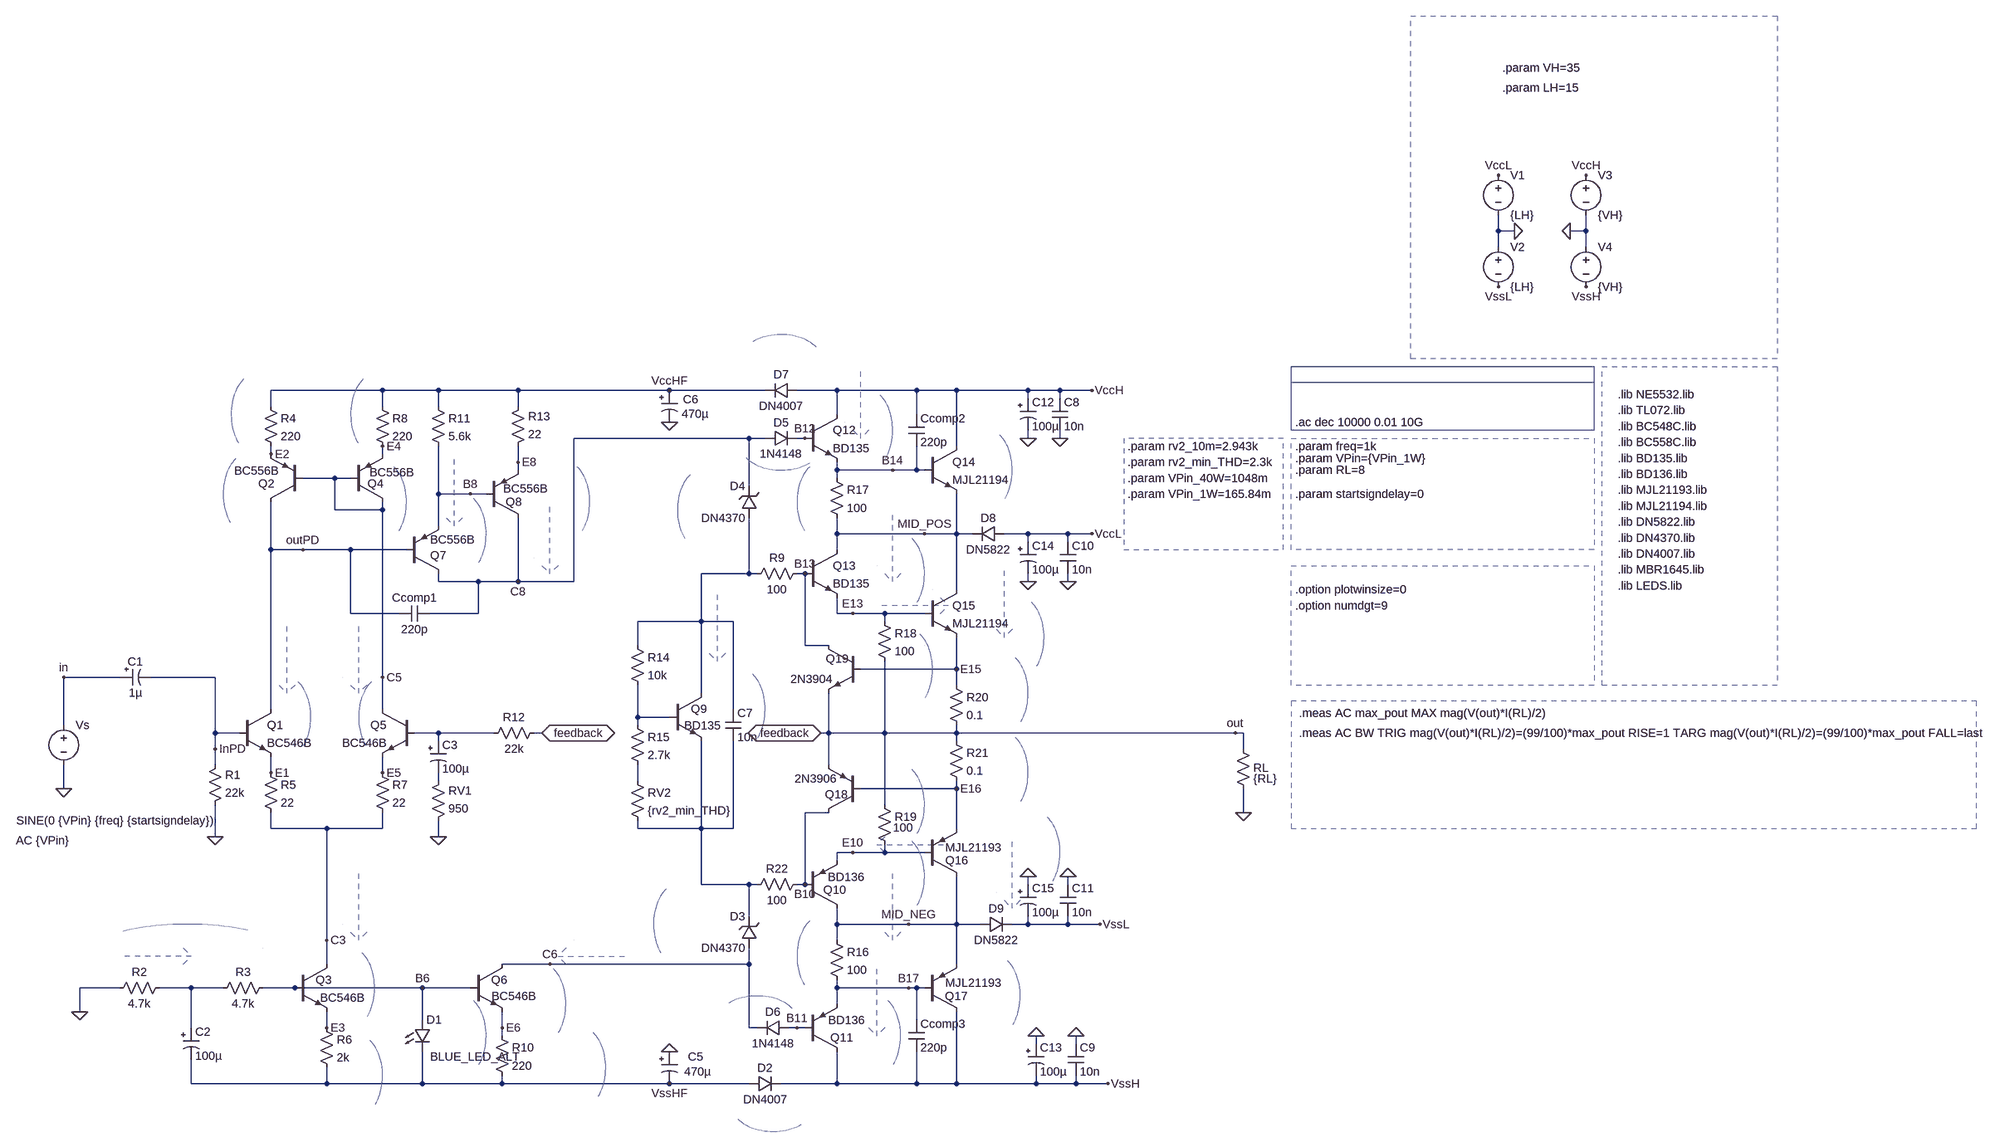
[diagram p0: schematic amplifier_1W_BW.asc]
amplifier_1W_BW.asc, the LTspice schematic file:
Version 4
SHEET 1 4560 1660
WIRE 3568 -400 3568 -432
WIRE 3600 -400 3568 -400
WIRE 3744 -400 3744 -432
WIRE 3744 -400 3712 -400
WIRE 3568 -368 3568 -400
WIRE 3744 -368 3744 -400
WIRE 1328 -80 1104 -80
WIRE 1440 -80 1328 -80
WIRE 1600 -80 1440 -80
WIRE 1904 -80 1600 -80
WIRE 2096 -80 1904 -80
WIRE 2240 -80 2160 -80
WIRE 2400 -80 2240 -80
WIRE 2480 -80 2400 -80
WIRE 2624 -80 2480 -80
WIRE 2688 -80 2624 -80
WIRE 2752 -80 2688 -80
WIRE 2624 -64 2624 -80
WIRE 2688 -64 2688 -80
WIRE 1104 -48 1104 -80
WIRE 1328 -48 1328 -80
WIRE 1440 -48 1440 -80
WIRE 1600 -48 1600 -80
WIRE 2240 -32 2240 -80
WIRE 2400 -32 2400 -80
WIRE 2064 16 1712 16
WIRE 2096 16 2064 16
WIRE 2176 16 2160 16
WIRE 2624 16 2624 0
WIRE 2688 16 2688 0
WIRE 2480 32 2480 -80
WIRE 1104 48 1104 32
WIRE 1328 48 1328 32
WIRE 1600 64 1600 32
WIRE 1600 80 1600 64
WIRE 2240 80 2240 64
WIRE 2352 80 2240 80
WIRE 2400 80 2400 32
WIRE 2400 80 2352 80
WIRE 2416 80 2400 80
WIRE 1232 96 1168 96
WIRE 1264 96 1232 96
WIRE 2240 96 2240 80
WIRE 2064 112 2064 16
WIRE 1440 128 1440 32
WIRE 1504 128 1440 128
WIRE 1536 128 1504 128
WIRE 1232 160 1232 96
WIRE 1328 160 1328 144
WIRE 1328 160 1232 160
WIRE 1440 192 1440 128
WIRE 2240 208 2240 176
WIRE 2416 208 2240 208
WIRE 2480 208 2480 128
WIRE 2480 208 2416 208
WIRE 2512 208 2480 208
WIRE 2624 208 2576 208
WIRE 2704 208 2624 208
WIRE 2752 208 2704 208
WIRE 2624 224 2624 208
WIRE 2704 224 2704 208
WIRE 1104 240 1104 144
WIRE 1168 240 1104 240
WIRE 1264 240 1168 240
WIRE 1376 240 1264 240
WIRE 2240 240 2240 208
WIRE 2064 288 2064 176
WIRE 2064 288 1968 288
WIRE 2080 288 2064 288
WIRE 2176 288 2160 288
WIRE 1440 304 1440 288
WIRE 1520 304 1440 304
WIRE 1600 304 1600 176
WIRE 1600 304 1520 304
WIRE 1712 304 1712 16
WIRE 1712 304 1600 304
WIRE 2624 304 2624 288
WIRE 2704 304 2704 288
WIRE 2480 320 2480 208
WIRE 1264 368 1264 240
WIRE 1360 368 1264 368
WIRE 1520 368 1520 304
WIRE 1520 368 1424 368
WIRE 2240 368 2240 336
WIRE 2272 368 2240 368
WIRE 2336 368 2272 368
WIRE 2416 368 2336 368
WIRE 1968 384 1968 288
WIRE 1968 384 1840 384
WIRE 2032 384 1968 384
WIRE 2336 384 2336 368
WIRE 1840 432 1840 384
WIRE 2176 432 2176 288
WIRE 2224 432 2176 432
WIRE 2480 480 2480 416
WIRE 2480 480 2288 480
WIRE 800 496 688 496
WIRE 992 496 864 496
WIRE 1328 496 1328 160
WIRE 2480 512 2480 480
WIRE 1968 528 1968 384
WIRE 1104 560 1104 240
WIRE 1328 560 1328 496
WIRE 2032 560 2032 384
WIRE 1840 576 1840 512
WIRE 1904 576 1840 576
WIRE 688 592 688 496
WIRE 1840 592 1840 576
WIRE 992 608 992 496
WIRE 1040 608 992 608
WIRE 1440 608 1392 608
WIRE 1552 608 1440 608
WIRE 1648 608 1632 608
WIRE 2224 608 2224 528
WIRE 2224 608 2208 608
WIRE 2336 608 2336 464
WIRE 2336 608 2224 608
WIRE 2480 608 2480 592
WIRE 2480 608 2336 608
WIRE 3040 608 2480 608
WIRE 3056 608 3040 608
WIRE 1440 624 1440 608
WIRE 2480 624 2480 608
WIRE 992 640 992 608
WIRE 3056 640 3056 608
WIRE 992 672 992 640
WIRE 2224 672 2224 608
WIRE 1104 688 1104 656
WIRE 1328 688 1328 656
WIRE 1440 704 1440 688
WIRE 1840 704 1840 672
WIRE 688 720 688 672
WIRE 2480 720 2480 704
WIRE 2480 720 2288 720
WIRE 2336 752 2336 608
WIRE 2224 768 2176 768
WIRE 3056 768 3056 720
WIRE 1104 800 1104 768
WIRE 1216 800 1104 800
WIRE 1328 800 1328 768
WIRE 1328 800 1216 800
WIRE 1840 800 1840 784
WIRE 1968 800 1968 624
WIRE 1968 800 1840 800
WIRE 2032 800 2032 624
WIRE 2032 800 1968 800
WIRE 2480 800 2480 720
WIRE 992 816 992 752
WIRE 1440 816 1440 784
WIRE 2272 848 2240 848
WIRE 2336 848 2336 832
WIRE 2336 848 2272 848
WIRE 2416 848 2336 848
WIRE 2240 864 2240 848
WIRE 1968 912 1968 800
WIRE 2064 912 1968 912
WIRE 2080 912 2064 912
WIRE 2176 912 2176 768
WIRE 2176 912 2160 912
WIRE 2624 912 2624 896
WIRE 2704 912 2704 896
WIRE 2064 976 2064 912
WIRE 2240 992 2240 960
WIRE 2384 992 2240 992
WIRE 2480 992 2480 896
WIRE 2480 992 2384 992
WIRE 2528 992 2480 992
WIRE 2624 992 2624 976
WIRE 2624 992 2592 992
WIRE 2704 992 2704 976
WIRE 2704 992 2624 992
WIRE 2768 992 2704 992
WIRE 1216 1024 1216 800
WIRE 2240 1024 2240 992
WIRE 1216 1072 1216 1024
WIRE 1664 1072 1568 1072
WIRE 2064 1072 2064 1040
WIRE 2064 1072 1664 1072
WIRE 2480 1072 2480 992
WIRE 800 1120 720 1120
WIRE 944 1120 880 1120
WIRE 1008 1120 944 1120
WIRE 1152 1120 1088 1120
WIRE 1408 1120 1152 1120
WIRE 1504 1120 1408 1120
WIRE 2240 1120 2240 1104
WIRE 2384 1120 2240 1120
WIRE 2400 1120 2384 1120
WIRE 2416 1120 2400 1120
WIRE 2240 1152 2240 1120
WIRE 720 1168 720 1120
WIRE 1408 1184 1408 1120
WIRE 2400 1184 2400 1120
WIRE 944 1200 944 1120
WIRE 1216 1200 1216 1168
WIRE 1568 1200 1568 1168
WIRE 2064 1200 2064 1072
WIRE 2080 1200 2064 1200
WIRE 2160 1200 2144 1200
WIRE 2176 1200 2160 1200
WIRE 1568 1216 1568 1200
WIRE 2640 1232 2640 1216
WIRE 2720 1232 2720 1216
WIRE 944 1312 944 1264
WIRE 1216 1312 1216 1280
WIRE 1216 1312 944 1312
WIRE 1408 1312 1408 1248
WIRE 1408 1312 1216 1312
WIRE 1568 1312 1568 1296
WIRE 1568 1312 1408 1312
WIRE 1904 1312 1568 1312
WIRE 2064 1312 1904 1312
WIRE 2240 1312 2240 1248
WIRE 2240 1312 2128 1312
WIRE 2400 1312 2400 1248
WIRE 2400 1312 2240 1312
WIRE 2480 1312 2480 1168
WIRE 2480 1312 2400 1312
WIRE 2640 1312 2640 1296
WIRE 2640 1312 2480 1312
WIRE 2720 1312 2720 1296
WIRE 2720 1312 2640 1312
WIRE 2784 1312 2720 1312
FLAG 3600 -400 0
FLAG 3712 -400 0
FLAG 3744 -512 VccH
FLAG 3568 -512 VccL
FLAG 3744 -288 VssH
FLAG 3568 -288 VssL
FLAG 688 720 0
FLAG 688 496 in
FLAG 2752 208 VccL
FLAG 2752 -80 VccH
FLAG 3056 768 0
FLAG 2784 1312 VssH
FLAG 3040 608 out
FLAG 1440 816 0
FLAG 992 816 0
FLAG 2768 992 VssL
FLAG 992 640 InPD
FLAG 1904 -16 0
FLAG 1904 1248 0
FLAG 2624 896 0
FLAG 2640 1216 0
FLAG 2624 304 0
FLAG 2624 16 0
FLAG 2688 16 0
FLAG 2720 1216 0
FLAG 2704 304 0
FLAG 2704 896 0
FLAG 1168 240 outPD
FLAG 2208 608 feedback
IOPIN 2208 608 BiDir
FLAG 1648 608 feedback
IOPIN 1648 608 BiDir
FLAG 720 1168 0
FLAG 2480 480 E15
FLAG 2480 720 E16
FLAG 2384 992 MID_NEG
FLAG 2416 208 MID_POS
FLAG 2384 1120 B17
FLAG 2352 80 B14
FLAG 2272 848 E10
FLAG 2272 368 E13
FLAG 2176 288 B13
FLAG 2176 912 B10
FLAG 1600 304 C8
FLAG 1664 1072 C6
FLAG 1904 -80 VccHF
FLAG 1904 1312 VssHF
FLAG 1568 1200 E6
FLAG 1600 64 E8
FLAG 1408 1120 B6
FLAG 1504 128 B8
FLAG 1216 1024 C3
FLAG 1216 1200 E3
FLAG 1328 496 C5
FLAG 1328 688 E5
FLAG 1104 688 E1
FLAG 2160 1200 B11
FLAG 2176 16 B12
FLAG 1104 48 E2
FLAG 1328 32 E4
DATAFLAG 2576 320 "Ic(Q15)"
DATAFLAG 2592 864 "-Ic(Q16)"
DATAFLAG 2624 608 ""
DATAFLAG 1008 608 ""
DATAFLAG 1472 608 ""
DATAFLAG 1776 1056 "Ic(Q6)"
DATAFLAG 1584 1072 ""
DATAFLAG 1984 288 ""
DATAFLAG 1984 912 ""
DATAFLAG 2592 80 "V(VccH,MID_POS)"
DATAFLAG 2656 416 "V(MID_POS,E15)"
DATAFLAG 2688 848 "V(E16,MID_NEG)"
DATAFLAG 2608 1136 "V(MID_NEG,VssH)"
DATAFLAG 2000 368 "Ic(Q9)"
DATAFLAG 1664 192 "-Ic(Q8)"
DATAFLAG 1104 320 ""
DATAFLAG 2352 256 "Ic(Q13)"
DATAFLAG 2352 928 "-Ic(Q10)"
DATAFLAG 1184 576 "V(outPD,E1)"
DATAFLAG 1280 544 "V(C5,E5)"
DATAFLAG 1280 928 "Ic(Q3)"
DATAFLAG 1136 432 "Ic(Q1)"
DATAFLAG 1280 432 "Ic(Q5)"
DATAFLAG 2352 0 "V(VccH,B14)"
DATAFLAG 2416 288 "V(MID_POS,E13)"
DATAFLAG 2416 896 "V(E10,MID_NEG)"
DATAFLAG 2368 1216 "V(B17,VssH)"
DATAFLAG 2096 560 "V(B13,B10)"
DATAFLAG 1696 1152 "V(C6,E6)"
DATAFLAG 1312 1120 "V(C3,E3)"
DATAFLAG 1536 208 "V(B8,C8)"
DATAFLAG 1472 96 "Ie(Q7)"
DATAFLAG 1488 128 ""
DATAFLAG 1744 144 "V(E8,C8)"
DATAFLAG 1696 1312 ""
DATAFLAG 1696 -80 ""
DATAFLAG 1328 320 ""
DATAFLAG 1536 1184 "V(B6,VssHF)"
DATAFLAG 2288 -80 "Ic(Q12)"
DATAFLAG 2320 1152 "-Ic(Q11)"
DATAFLAG 1984 16 ""
DATAFLAG 1936 1072 ""
DATAFLAG 2128 -192 "V(VccH,VccHF)"
DATAFLAG 2624 528 "V(E15,out)"
DATAFLAG 2624 688 "V(out,E16)"
DATAFLAG 2160 144 "V(B14,MID_POS)"
DATAFLAG 2160 1056 "V(MID_NEG,B17)"
DATAFLAG 1920 160 "V(C8,B13)"
DATAFLAG 1872 992 "V(B10,C6)"
DATAFLAG 2112 1408 "V(VssHF,VssH)"
DATAFLAG 1328 1296 "V(E3,VssHF)"
DATAFLAG 848 1056 "I(R2)"
DATAFLAG 944 992 "-V(B6)"
DATAFLAG 2080 1136 "V(C6,B11)"
DATAFLAG 2128 80 "V(C8,B12)"
DATAFLAG 1008 128 "V(E2,outPD)"
DATAFLAG 1376 144 "V(E4,C5)"
DATAFLAG 1024 -32 "V(VccHF,E2)"
DATAFLAG 1264 -32 "V(VccHF,E4)"
DATAFLAG 2416 752 "V(out,E10)"
DATAFLAG 2432 480 "V(E13,out)"
DATAFLAG 2624 -80 ""
DATAFLAG 2624 208 ""
DATAFLAG 2624 992 ""
DATAFLAG 2640 1312 ""
DATAFLAG 2352 352 "Ib(Q15)"
DATAFLAG 2432 832 "-Ib(Q16)"
DATAFLAG 1776 1280 "V(E6)-V(VssHF)"
SYMBOL voltage 3568 -528 R0
WINDOW 123 0 0 Left 0
WINDOW 39 0 0 Left 0
SYMATTR InstName V1
SYMATTR Value {LH}
SYMBOL voltage 3568 -384 R0
WINDOW 123 0 0 Left 0
WINDOW 39 0 0 Left 0
SYMATTR InstName V2
SYMATTR Value {LH}
SYMBOL voltage 3744 -528 R0
WINDOW 123 0 0 Left 0
WINDOW 39 0 0 Left 0
SYMATTR InstName V3
SYMATTR Value {VH}
SYMBOL voltage 3744 -384 R0
WINDOW 123 0 0 Left 0
WINDOW 39 0 0 Left 0
SYMATTR InstName V4
SYMATTR Value {VH}
SYMBOL voltage 688 576 R0
WINDOW 123 -96 248 Left 2
WINDOW 39 0 0 Left 0
WINDOW 3 -95 208 Left 2
SYMATTR Value2 AC {VPin}
SYMATTR Value SINE(0 {VPin} {freq} {startsigndelay})
SYMATTR InstName Vs
SYMBOL res 3040 624 R0
WINDOW 0 36 54 Left 2
SYMATTR InstName RL
SYMATTR Value {RL}
SYMBOL diode 2096 32 R270
WINDOW 0 32 32 VTop 2
WINDOW 3 0 32 VBottom 2
SYMATTR InstName D5
SYMATTR Value 1N4148
SYMBOL diode 2144 1184 R90
WINDOW 0 0 32 VBottom 2
WINDOW 3 32 32 VTop 2
SYMATTR InstName D6
SYMATTR Value 1N4148
SYMBOL npn 1904 528 R0
WINDOW 0 43 32 Left 2
WINDOW 3 30 65 Left 2
SYMATTR InstName Q9
SYMATTR Value BD135
SYMBOL res 1824 416 R0
SYMATTR InstName R14
SYMATTR Value 10k
SYMBOL res 1824 576 R0
SYMATTR InstName R15
SYMATTR Value 2.7k
SYMBOL npn 1504 1072 R0
WINDOW 0 42 32 Left 2
WINDOW 3 43 64 Left 2
SYMATTR InstName Q6
SYMATTR Value BC546B
SYMBOL res 1552 1200 R0
SYMATTR InstName R10
SYMATTR Value 220
SYMBOL npn 1392 560 M0
SYMATTR InstName Q5
SYMATTR Value BC546B
SYMBOL res 1648 592 R90
WINDOW 0 0 56 VBottom 2
WINDOW 3 32 56 VTop 2
SYMATTR InstName R12
SYMATTR Value 22k
SYMBOL res 1424 800 M180
WINDOW 0 36 76 Left 2
WINDOW 3 36 40 Left 2
SYMATTR InstName RV1
SYMATTR Value 950
SYMBOL npn 1040 560 R0
SYMATTR InstName Q1
SYMATTR Value BC546B
SYMBOL npn 1152 1072 R0
WINDOW 0 42 32 Left 2
WINDOW 3 51 68 Left 2
SYMATTR InstName Q3
SYMATTR Value BC546B
SYMBOL res 1200 1184 R0
SYMATTR InstName R6
SYMATTR Value 2k
SYMBOL res 1104 1104 R90
WINDOW 0 0 56 VBottom 2
WINDOW 3 32 56 VTop 2
SYMATTR InstName R3
SYMATTR Value 4.7k
SYMBOL res 976 768 M180
WINDOW 0 36 76 Left 2
WINDOW 3 36 40 Left 2
SYMATTR InstName R1
SYMATTR Value 22k
SYMBOL res 784 1136 R270
WINDOW 0 32 56 VTop 2
WINDOW 3 0 56 VBottom 2
SYMATTR InstName R2
SYMATTR Value 4.7k
SYMBOL pnp 1168 144 R180
WINDOW 0 57 37 Left 2
WINDOW 3 48 63 Left 2
SYMATTR InstName Q2
SYMATTR Value BC556B
SYMBOL pnp 1264 144 M180
WINDOW 0 34 37 Left 2
WINDOW 3 38 59 Left 2
SYMATTR InstName Q4
SYMATTR Value BC556B
SYMBOL res 1424 -64 R0
SYMATTR InstName R11
SYMATTR Value 5.6k
SYMBOL pnp 1376 288 M180
WINDOW 0 48 37 Left 2
WINDOW 3 48 68 Left 2
SYMATTR InstName Q7
SYMATTR Value BC556B
SYMBOL zener 2080 1040 R180
WINDOW 0 24 64 Left 2
WINDOW 3 24 0 Left 2
SYMATTR InstName D3
SYMATTR Value DN4370
SYMBOL zener 2080 176 R180
WINDOW 0 24 64 Left 2
WINDOW 3 24 0 Left 2
SYMATTR InstName D4
SYMATTR Value DN4370
SYMBOL res 1584 48 M180
WINDOW 0 36 76 Left 2
WINDOW 3 36 40 Left 2
SYMATTR InstName R13
SYMATTR Value 22
SYMBOL pnp 1536 176 M180
WINDOW 0 39 32 Left 2
WINDOW 3 34 59 Left 2
SYMATTR InstName Q8
SYMATTR Value BC556B
SYMBOL cap 1424 352 R90
WINDOW 0 0 32 VBottom 2
WINDOW 3 32 32 VTop 2
SYMATTR InstName Ccomp1
SYMATTR Value 220p
SYMBOL diode 2064 1328 R270
WINDOW 0 32 32 VTop 2
WINDOW 3 0 32 VBottom 2
SYMATTR InstName D2
SYMATTR Value DN4007
SYMBOL diode 2160 -96 R90
WINDOW 0 0 32 VBottom 2
WINDOW 3 32 32 VTop 2
SYMATTR InstName D7
SYMATTR Value DN4007
SYMBOL res 1088 -64 R0
SYMATTR InstName R4
SYMATTR Value 220
SYMBOL res 1312 -64 R0
SYMATTR InstName R8
SYMATTR Value 220
SYMBOL cap 2672 -64 R0
SYMATTR InstName C8
SYMATTR Value 10n
SYMBOL cap 2704 1232 R0
SYMATTR InstName C9
SYMATTR Value 10n
SYMBOL cap 2688 288 M180
WINDOW 0 24 56 Left 2
WINDOW 3 24 8 Left 2
SYMATTR InstName C10
SYMATTR Value 10n
SYMBOL cap 2688 976 M180
WINDOW 0 24 56 Left 2
WINDOW 3 24 8 Left 2
SYMATTR InstName C11
SYMATTR Value 10n
SYMBOL diode 2528 1008 R270
WINDOW 0 32 32 VTop 2
WINDOW 3 0 32 VBottom 2
SYMATTR InstName D9
SYMATTR Value DN5822
SYMBOL diode 2576 192 R90
WINDOW 0 0 32 VBottom 2
WINDOW 3 32 32 VTop 2
SYMATTR InstName D8
SYMATTR Value DN5822
SYMBOL npn 2288 432 M0
WINDOW 0 24 27 Left 2
SYMATTR InstName Q19
SYMATTR Value 2N3904
SYMBOL pnp 2288 768 R180
WINDOW 0 26 37 Left 2
WINDOW 3 48 68 Left 2
SYMATTR InstName Q18
SYMATTR Value 2N3906
SYMBOL res 1088 672 R0
SYMATTR InstName R5
SYMATTR Value 22
SYMBOL res 1312 672 R0
SYMATTR InstName R7
SYMATTR Value 22
SYMBOL res 2464 608 R0
SYMATTR InstName R21
SYMATTR Value 0.1
SYMBOL res 2464 496 R0
SYMATTR InstName R20
SYMATTR Value 0.1
SYMBOL npn 2176 240 R0
SYMATTR InstName Q13
SYMATTR Value BD135
SYMBOL npn 2416 320 R0
SYMATTR InstName Q15
SYMATTR Value MJL21194
SYMBOL npn 2176 -32 R0
SYMATTR InstName Q12
SYMATTR Value BD135
SYMBOL npn 2416 32 R0
SYMATTR InstName Q14
SYMATTR Value MJL21194
SYMBOL pnp 2416 896 M180
WINDOW 0 42 32 Left 2
WINDOW 3 42 58 Left 2
SYMATTR InstName Q16
SYMATTR Value MJL21193
SYMBOL pnp 2176 960 M180
WINDOW 0 37 37 Left 2
WINDOW 3 46 63 Left 2
SYMATTR InstName Q10
SYMATTR Value BD136
SYMBOL pnp 2416 1168 M180
WINDOW 0 41 32 Left 2
WINDOW 3 42 58 Left 2
SYMATTR InstName Q17
SYMATTR Value MJL21193
SYMBOL pnp 2176 1248 M180
WINDOW 0 51 28 Left 2
WINDOW 3 47 63 Left 2
SYMATTR InstName Q11
SYMATTR Value BD136
SYMBOL res 2224 1008 R0
SYMATTR InstName R16
SYMATTR Value 100
SYMBOL res 2320 736 R0
WINDOW 3 73 62 Right 2
SYMATTR Value 100
SYMATTR InstName R19
SYMBOL res 2320 368 R0
SYMATTR InstName R18
SYMATTR Value 100
SYMBOL res 2224 80 R0
SYMATTR InstName R17
SYMATTR Value 100
SYMBOL res 1824 688 R0
SYMATTR InstName RV2
SYMATTR Value {rv2_min_THD}
SYMBOL cap 2016 560 R0
SYMATTR InstName C7
SYMATTR Value 10n
SYMBOL polcap 800 480 M90
WINDOW 0 0 32 VBottom 2
WINDOW 3 32 32 VTop 2
SYMATTR InstName C1
SYMATTR Value 1µ
SYMBOL polcap 1424 624 R0
SYMATTR InstName C3
SYMATTR Value 100µ
SYMBOL polcap 1888 -80 R0
WINDOW 0 43 18 Left 2
WINDOW 3 41 47 Left 2
SYMATTR InstName C6
SYMATTR Value 470µ
SYMBOL polcap 1888 1248 R0
WINDOW 0 53 10 Left 2
WINDOW 3 46 40 Left 2
SYMATTR InstName C5
SYMATTR Value 470µ
SYMBOL polcap 2608 -64 R0
SYMATTR InstName C12
SYMATTR Value 100µ
SYMBOL polcap 2624 1232 R0
SYMATTR InstName C13
SYMATTR Value 100µ
SYMBOL polcap 2608 224 R0
SYMATTR InstName C14
SYMATTR Value 100µ
SYMBOL polcap 2608 912 R0
SYMATTR InstName C15
SYMATTR Value 100µ
SYMBOL polcap 928 1200 R0
SYMATTR InstName C2
SYMATTR Value 100µ
SYMBOL LED 1392 1184 R0
WINDOW 3 32 74 Left 2
SYMATTR Value BLUE_LED_ALT
SYMATTR InstName D1
SYMBOL cap 2384 -32 R0
SYMATTR InstName Ccomp2
SYMATTR Value 220p
SYMBOL cap 2384 1184 R0
SYMATTR InstName Ccomp3
SYMATTR Value 220p
SYMBOL res 2064 304 R270
WINDOW 0 32 56 VTop 2
WINDOW 3 0 56 VBottom 2
SYMATTR InstName R9
SYMATTR Value 100
SYMBOL res 2064 928 R270
WINDOW 0 32 56 VTop 2
WINDOW 3 0 56 VBottom 2
SYMATTR InstName R22
SYMATTR Value 100
TEXT 3808 -8 Left 2 !.lib BC548C.lib
TEXT 3808 280 Left 2 !.lib MBR1645.lib
TEXT 3808 -40 Left 2 !.lib TL072.lib
TEXT 3808 216 Left 2 !.lib DN4370.lib
TEXT 3808 120 Left 2 !.lib MJL21193.lib
TEXT 3808 152 Left 2 !.lib MJL21194.lib
TEXT 3808 184 Left 2 !.lib DN5822.lib
TEXT 3808 248 Left 2 !.lib DN4007.lib
TEXT 3808 24 Left 2 !.lib BC558C.lib
TEXT 3808 56 Left 2 !.lib BD135.lib
TEXT 3808 88 Left 2 !.lib BD136.lib
TEXT 3160 320 Left 2 !.option plotwinsize=0
TEXT 3160 352 Left 2 !.option numdgt=9
TEXT 3160 32 Left 2 !.param freq=1k
TEXT 3160 -16 Left 2 !.ac dec 10000 0.01 10G
TEXT 3160 56 Left 2 !.param VPin={VPin_1W}
TEXT 3160 80 Left 2 !.param RL=8
TEXT 3160 128 Left 2 !.param startsigndelay=0
TEXT 3808 -72 Left 2 !.lib NE5532.lib
TEXT 3808 312 Left 2 !.lib LEDS.lib
TEXT 3576 -728 Left 2 !.param VH=35
TEXT 3576 -688 Left 2 !.param LH=15
TEXT 3168 608 Left 2 !.meas AC BW TRIG mag(V(out)*I(RL)/2)=(99/100)*max_pout RISE=1 TARG mag(V(out)*I(RL)/2)=(99/100)*max_pout FALL=last
TEXT 3168 568 Left 2 !.meas AC max_pout MAX mag(V(out)*I(RL)/2)
TEXT 2824 32 Left 2 !.param rv2_10m=2.943k
TEXT 2824 64 Left 2 !.param rv2_min_THD=2.3k
TEXT 2824 96 Left 2 !.param VPin_40W=1048m
TEXT 2824 128 Left 2 !.param VPin_1W=165.84m
LINE Normal 2576 416 2576 272 2
LINE Normal 2576 416 2576 416 2
LINE Normal 2576 416 2576 416 2
LINE Normal 2560 400 2576 416 2
LINE Normal 2560 400 2560 400 2
LINE Normal 2592 400 2576 416 2
LINE Normal 2544 384 2544 384 2
LINE Normal 2592 960 2592 816 2
LINE Normal 2592 960 2592 960 2
LINE Normal 2592 960 2592 960 2
LINE Normal 2576 944 2592 960 2
LINE Normal 2576 944 2576 944 2
LINE Normal 2608 944 2592 960 2
LINE Normal 2560 928 2560 928 2
LINE Normal 3760 -96 3152 -96
LINE Normal 3760 -96 3760 -96 2
LINE Normal 3760 -128 3760 -128 2
LINE Normal 1680 1056 1824 1056 2
LINE Normal 1680 1056 1680 1056 2
LINE Normal 1680 1056 1680 1056 2
LINE Normal 1696 1040 1680 1056 2
LINE Normal 1696 1040 1696 1040 2
LINE Normal 1696 1072 1680 1056 2
LINE Normal 1712 1024 1712 1024 2
LINE Normal 2000 464 2000 320 2
LINE Normal 2000 464 2000 464 2
LINE Normal 2000 464 2000 464 2
LINE Normal 1984 448 2000 464 2
LINE Normal 1984 448 1984 448 2
LINE Normal 2016 448 2000 464 2
LINE Normal 1968 432 1968 432 2
LINE Normal 1664 288 1664 144 2
LINE Normal 1664 288 1664 288 2
LINE Normal 1664 288 1664 288 2
LINE Normal 1648 272 1664 288 2
LINE Normal 1648 272 1648 272 2
LINE Normal 1680 272 1664 288 2
LINE Normal 1632 256 1632 256 2
LINE Normal 2352 304 2352 160 2
LINE Normal 2352 304 2352 304 2
LINE Normal 2352 304 2352 304 2
LINE Normal 2336 288 2352 304 2
LINE Normal 2336 288 2336 288 2
LINE Normal 2368 288 2352 304 2
LINE Normal 2320 272 2320 272 2
LINE Normal 2352 1024 2352 880 2
LINE Normal 2352 1024 2352 1024 2
LINE Normal 2352 1024 2352 1024 2
LINE Normal 2336 1008 2352 1024 2
LINE Normal 2336 1008 2336 1008 2
LINE Normal 2368 1008 2352 1024 2
LINE Normal 2320 992 2320 992 2
LINE Normal 1280 1024 1280 880 2
LINE Normal 1280 1024 1280 1024 2
LINE Normal 1280 1024 1280 1024 2
LINE Normal 1264 1008 1280 1024 2
LINE Normal 1264 1008 1264 1008 2
LINE Normal 1296 1008 1280 1024 2
LINE Normal 1248 992 1248 992 2
LINE Normal 1136 528 1136 384 2
LINE Normal 1136 528 1136 528 2
LINE Normal 1136 528 1136 528 2
LINE Normal 1120 512 1136 528 2
LINE Normal 1120 512 1120 512 2
LINE Normal 1152 512 1136 528 2
LINE Normal 1104 496 1104 496 2
LINE Normal 1280 528 1280 384 2
LINE Normal 1280 528 1280 528 2
LINE Normal 1280 528 1280 528 2
LINE Normal 1264 512 1280 528 2
LINE Normal 1264 512 1264 512 2
LINE Normal 1296 512 1280 528 2
LINE Normal 1248 496 1248 496 2
LINE Normal 1728 96 1728 96 2
LINE Normal 1472 192 1472 48 2
LINE Normal 1472 192 1472 192 2
LINE Normal 1472 192 1472 192 2
LINE Normal 1456 176 1472 192 2
LINE Normal 1456 176 1456 176 2
LINE Normal 1488 176 1472 192 2
LINE Normal 1440 160 1440 160 2
LINE Normal 2288 16 2288 -128 2
LINE Normal 2288 16 2288 16 2
LINE Normal 2288 16 2288 16 2
LINE Normal 2272 0 2288 16 2
LINE Normal 2272 0 2272 0 2
LINE Normal 2304 0 2288 16 2
LINE Normal 2256 -16 2256 -16 2
LINE Normal 2320 1216 2320 1072 2
LINE Normal 2320 1216 2320 1216 2
LINE Normal 2320 1216 2320 1216 2
LINE Normal 2304 1200 2320 1216 2
LINE Normal 2304 1200 2304 1200 2
LINE Normal 2336 1200 2320 1216 2
LINE Normal 2288 1184 2288 1184 2
LINE Normal 944 1056 800 1056 2
LINE Normal 944 1056 944 1056 2
LINE Normal 944 1056 944 1056 2
LINE Normal 928 1040 944 1056 2
LINE Normal 928 1040 928 1040 2
LINE Normal 928 1072 944 1056 2
LINE Normal 1088 1040 1088 1040 2
LINE Normal 2400 704 2400 704 2
LINE Normal 2416 432 2416 432 2
LINE Normal 2464 352 2320 352 2
LINE Normal 2464 352 2464 352 2
LINE Normal 2464 352 2464 352 2
LINE Normal 2448 336 2464 352 2
LINE Normal 2448 336 2448 336 2
LINE Normal 2448 368 2464 352 2
LINE Normal 2432 320 2432 320 2
LINE Normal 2320 832 2464 832 2
LINE Normal 2320 832 2320 832 2
LINE Normal 2320 832 2320 832 2
LINE Normal 2336 816 2320 832 2
LINE Normal 2336 816 2336 816 2
LINE Normal 2336 848 2320 832 2
LINE Normal 2352 800 2352 800 2
RECTANGLE Normal 3760 512 3152 272 3
RECTANGLE Normal 3760 0 3152 -128
RECTANGLE Normal 3760 240 3152 16 3
RECTANGLE Normal 4128 512 3776 -128 2
RECTANGLE Normal 4128 -144 3392 -832 3
RECTANGLE Normal 3152 800 4528 544 3
RECTANGLE Normal 2816 240 3136 16 2
ARC Normal 2496 0 2592 160 2590 158 2569 3 2
ARC Normal 2560 336 2656 496 2654 494 2633 339 2
ARC Normal 2592 768 2688 928 2686 926 2665 771 2
ARC Normal 2512 1056 2608 1216 2606 1214 2585 1059 2
ARC Normal 1088 496 1184 656 1182 654 1161 499 2
ARC Normal 1376 496 1280 656 1303 499 1282 654 2
ARC Normal 2256 -80 2352 80 2350 78 2329 -77 2
ARC Normal 2320 208 2416 368 2414 366 2393 211 2
ARC Normal 2320 816 2416 976 2414 974 2393 819 2
ARC Normal 2272 1136 2368 1296 2366 1294 2345 1139 2
ARC Normal 2000 480 2096 640 2094 638 2073 483 2
ARC Normal 1600 1072 1696 1232 1694 1230 1673 1075 2
ARC Normal 1216 1040 1312 1200 1310 1198 1289 1043 2
ARC Normal 1440 128 1536 288 1534 286 1513 131 2
ARC Normal 1648 64 1744 224 1742 222 1721 67 2
ARC Normal 1440 1136 1536 1296 1534 1294 1513 1139 2
ARC Normal 2208 -96 2048 -192 2205 -169 2050 -190 2
ARC Normal 2528 448 2624 608 2622 606 2601 451 2
ARC Normal 2528 608 2624 768 2622 766 2601 611 2
ARC Normal 2256 64 2160 224 2183 67 2162 222 2
ARC Normal 2256 976 2160 1136 2183 979 2162 1134 2
ARC Normal 2016 80 1920 240 1943 83 1922 238 2
ARC Normal 1968 912 1872 1072 1895 915 1874 1070 2
ARC Normal 2032 1312 2192 1408 2035 1385 2190 1406 2
ARC Normal 1232 1216 1328 1376 1326 1374 1305 1219 2
ARC Normal 768 1072 1104 992 1102 994 771 999 2
ARC Normal 2160 1232 2000 1136 2157 1159 2002 1138 2
ARC Normal 2048 -16 2208 80 2051 57 2206 78 2
ARC Normal 1104 48 1008 208 1031 51 1010 206 2
ARC Normal 1280 64 1376 224 1374 222 1353 67 2
ARC Normal 1120 -112 1024 48 1047 -109 1026 46 2
ARC Normal 1360 -112 1264 48 1287 -109 1266 46 2
ARC Normal 2320 672 2416 832 2414 830 2393 675 2
ARC Normal 2336 400 2432 560 2430 558 2409 403 2
ARC Normal 1680 1200 1776 1360 1774 1358 1753 1203 2

The netlist it stands for:
* amplifier_1W_BW.asc
V1 VccL 0 {LH}
V2 0 VssL {LH}
V3 VccH 0 {VH}
V4 0 VssH {VH}
Vs in 0 SINE(0 {VPin} {freq} {startsigndelay}) AC {VPin}
RL feedback 0 {RL}
D5 C8 B12 1N4148
D6 B11 C6 1N4148
Q9 N001 N002 N006 0 BD135
R14 N001 N002 10k
R15 N002 N005 2.7k
Q6 C6 B6 E6 0 BC546B
R10 E6 VssHF 220
Q5 C5 N003 E5 0 BC546B
R12 feedback N003 22k
RV1 0 N004 950
Q1 outPD InPD E1 0 BC546B
Q3 C3 B6 E3 0 BC546B
R6 E3 VssHF 2k
R3 B6 N007 4.7k
R1 0 InPD 22k
R2 0 N007 4.7k
Q2 outPD C5 E2 0 BC556B
Q4 C5 C5 E4 0 BC556B
R11 VccHF B8 5.6k
Q7 C8 outPD B8 0 BC556B
D3 C6 N006 DN4370
D4 N001 C8 DN4370
R13 E8 VccHF 22
Q8 C8 B8 E8 0 BC556B
Ccomp1 C8 outPD 220p
D2 VssHF VssH DN4007
D7 VccH VccHF DN4007
R4 VccHF E2 220
R8 VccHF E4 220
C8 VccH 0 10n
C9 0 VssH 10n
C10 0 VccL 10n
C11 VssL 0 10n
D9 MID_NEG VssL DN5822
D8 VccL MID_POS DN5822
Q19 B13 E15 feedback 0 2N3904
Q18 B10 E16 feedback 0 2N3906
R5 E1 C3 22
R7 E5 C3 22
R21 feedback E16 0.1
R20 E15 feedback 0.1
Q13 MID_POS B13 E13 0 BD135
Q15 MID_POS E13 E15 0 MJL21194
Q12 VccH B12 B14 0 BD135
Q14 VccH B14 MID_POS 0 MJL21194
Q16 MID_NEG E10 E16 0 MJL21193
Q10 MID_NEG B10 E10 0 BD136
Q17 VssH B17 MID_NEG 0 MJL21193
Q11 VssH B11 B17 0 BD136
R16 MID_NEG B17 100
R19 feedback E10 100
R18 E13 feedback 100
R17 B14 MID_POS 100
RV2 N005 N006 {rv2_min_THD}
C7 N001 N006 10n
C1 in InPD 1µ
C3 N003 N004 100µ
C6 VccHF 0 470µ
C5 0 VssHF 470µ
C12 VccH 0 100µ
C13 0 VssH 100µ
C14 VccL 0 100µ
C15 0 VssL 100µ
C2 N007 VssHF 100µ
D1 B6 VssHF BLUE_LED_ALT
Ccomp2 VccH B14 220p
Ccomp3 B17 VssH 220p
R9 N001 B13 100
R22 N006 B10 100
.model D D
.lib standard.dio
.model NPN NPN
.model PNP PNP
.lib standard.bjt
.lib BC548C.lib
.lib MBR1645.lib
.lib TL072.lib
.lib DN4370.lib
.lib MJL21193.lib
.lib MJL21194.lib
.lib DN5822.lib
.lib DN4007.lib
.lib BC558C.lib
.lib BD135.lib
.lib BD136.lib
.option plotwinsize=0
.option numdgt=9
.param freq=1k
.ac dec 10000 0.01 10G
.param VPin={VPin_1W}
.param RL=8
.param startsigndelay=0
.lib NE5532.lib
.lib LEDS.lib
.param VH=35
.param LH=15
.meas AC BW TRIG mag(V(out)*I(RL)/2)=(99/100)*max_pout RISE=1 TARG mag(V(out)*I(RL)/2)=(99/100)*max_pout FALL=last
.meas AC max_pout MAX mag(V(out)*I(RL)/2)
.param rv2_10m=2.943k
.param rv2_min_THD=2.3k
.param VPin_40W=1048m
.param VPin_1W=165.84m
.backanno
.end